# EasyEDA Pro project ProDoc_cyrus_V2.epro, schematic cyrus, sheets 1 to 3 of 5

## Sheets
1 CN3791: Board Name: Board2; Create Date: 2026-04-17; Page Name: CN3791; Project Name: cyrus v1; Schematic Name: cyrus; Update Date: 2026-04-22; Company: EasyEDA.com; Page Size: A3; Version: V1.0
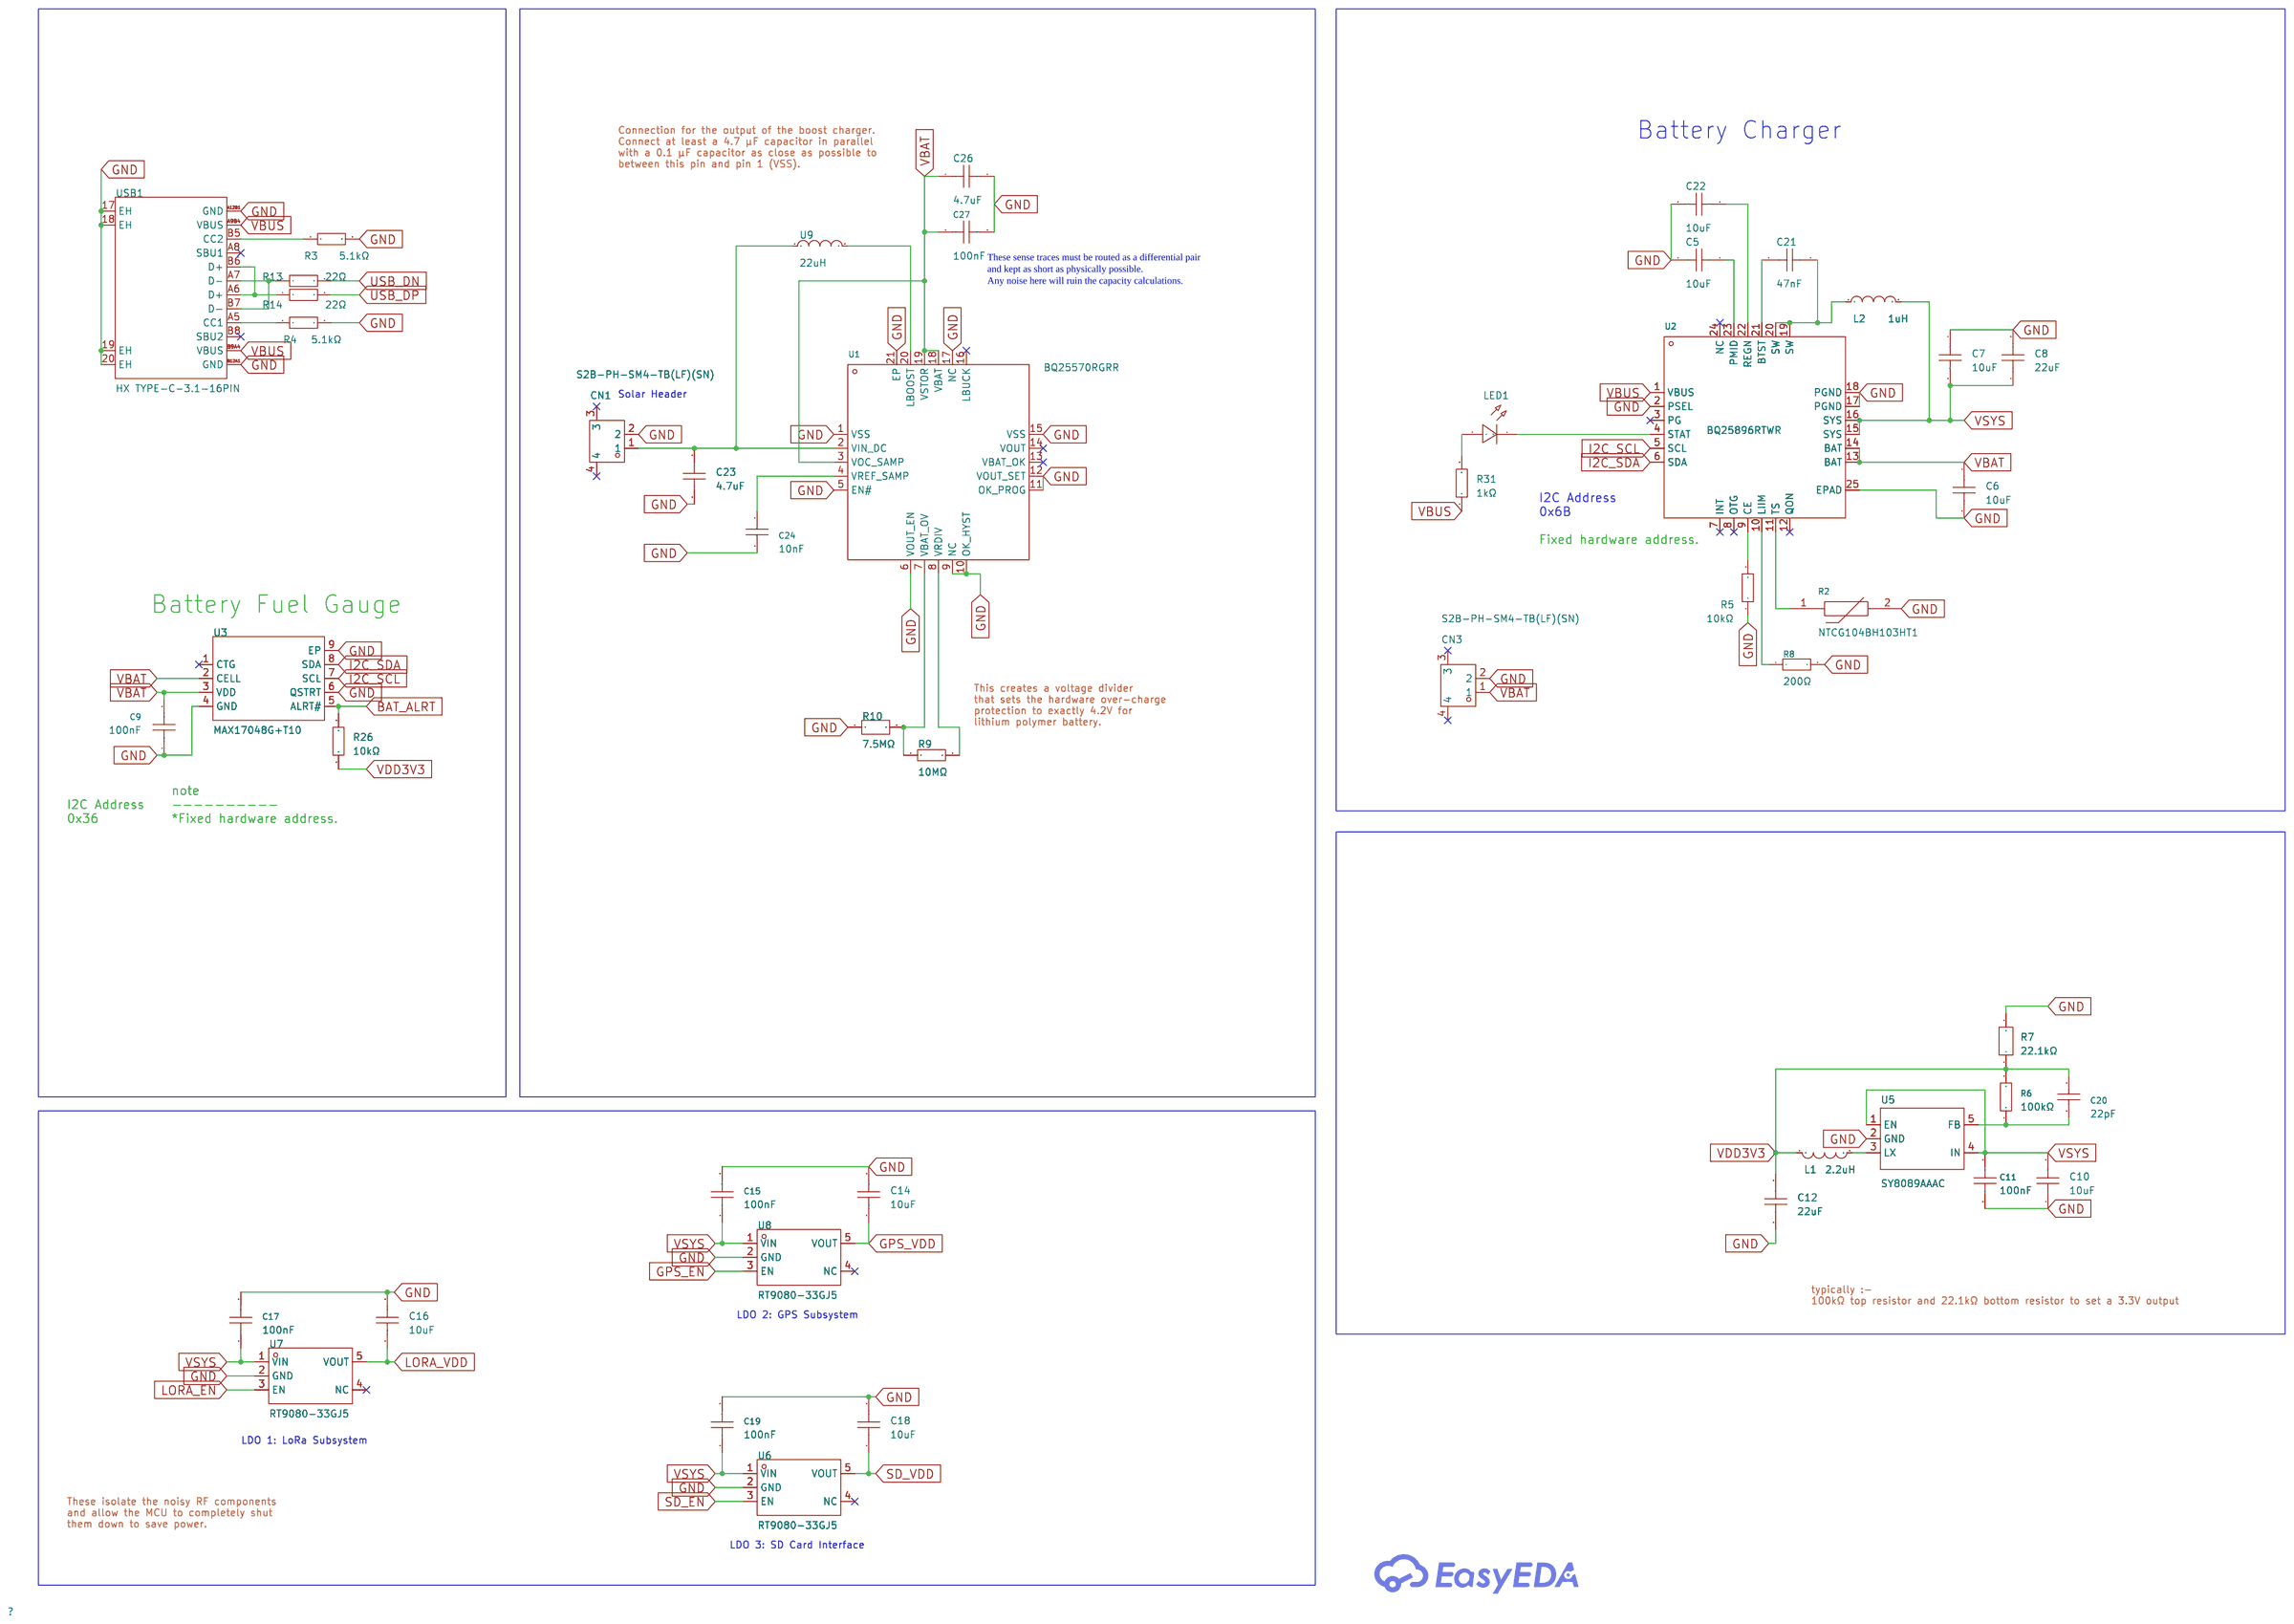
[diagram p0: CN3791]
2 Core Compute: Page Name: Core Compute
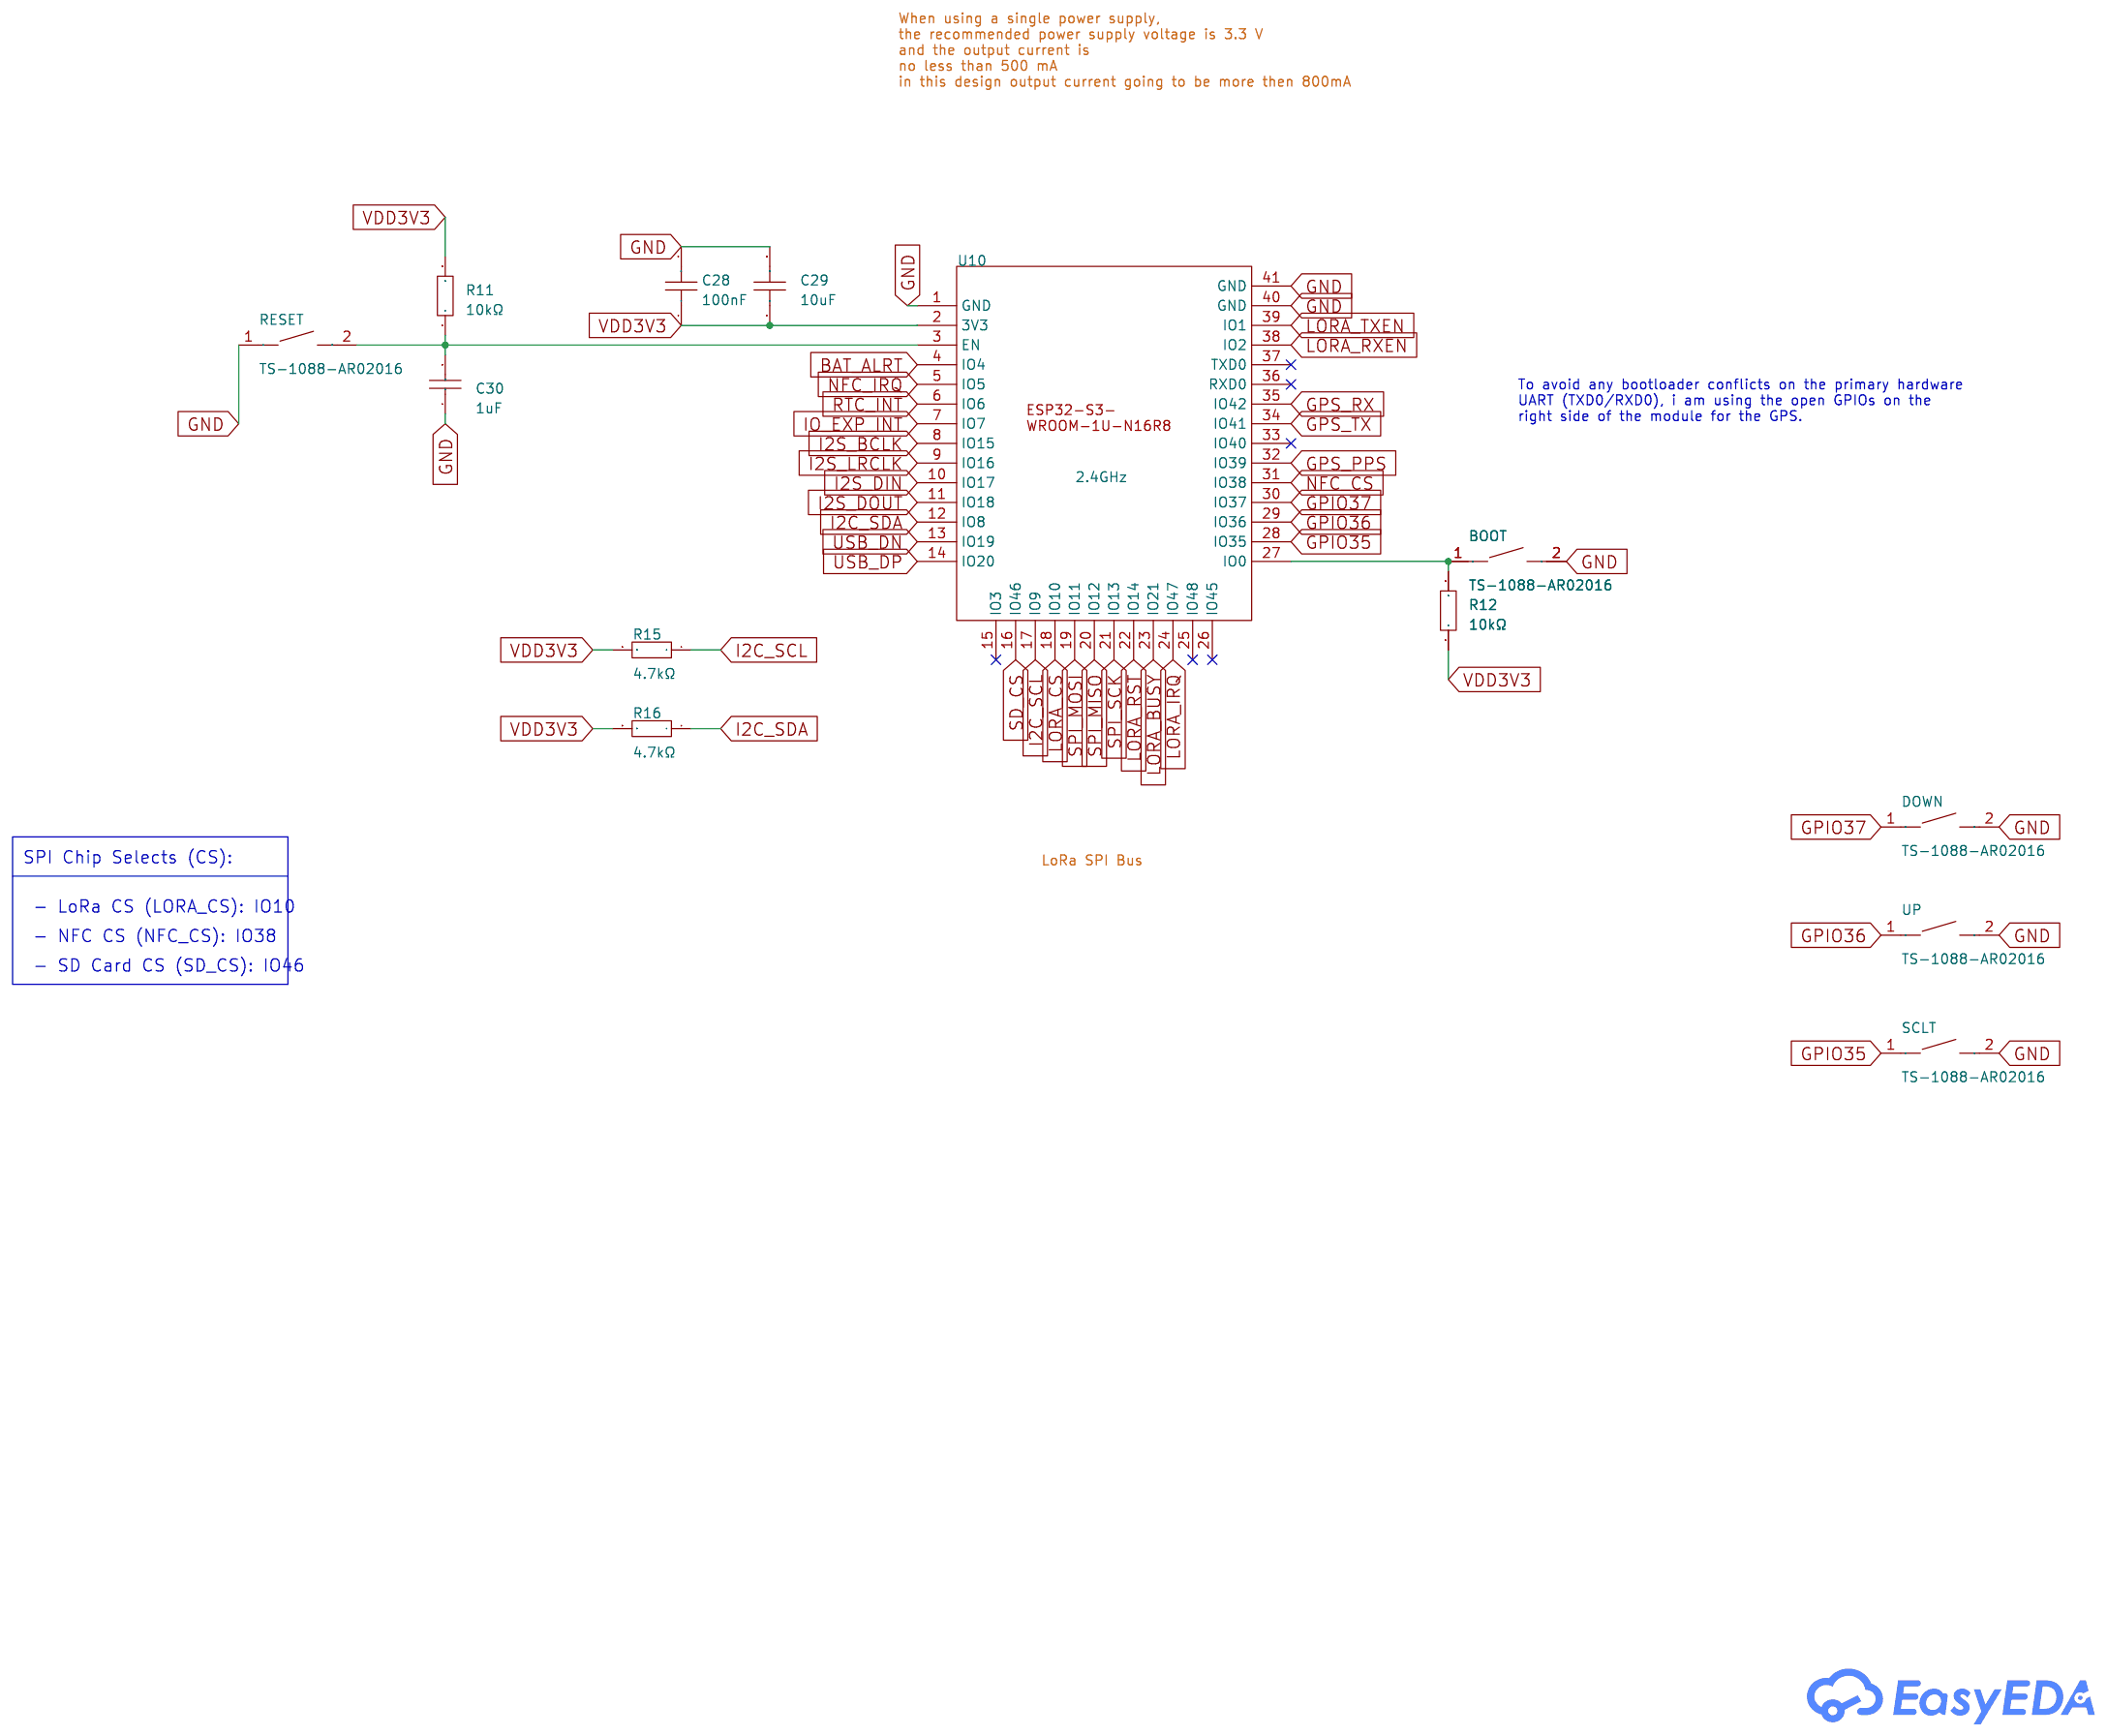
[diagram p1: Core Compute]
3 IO Expansion: Page Name: IO Expansion
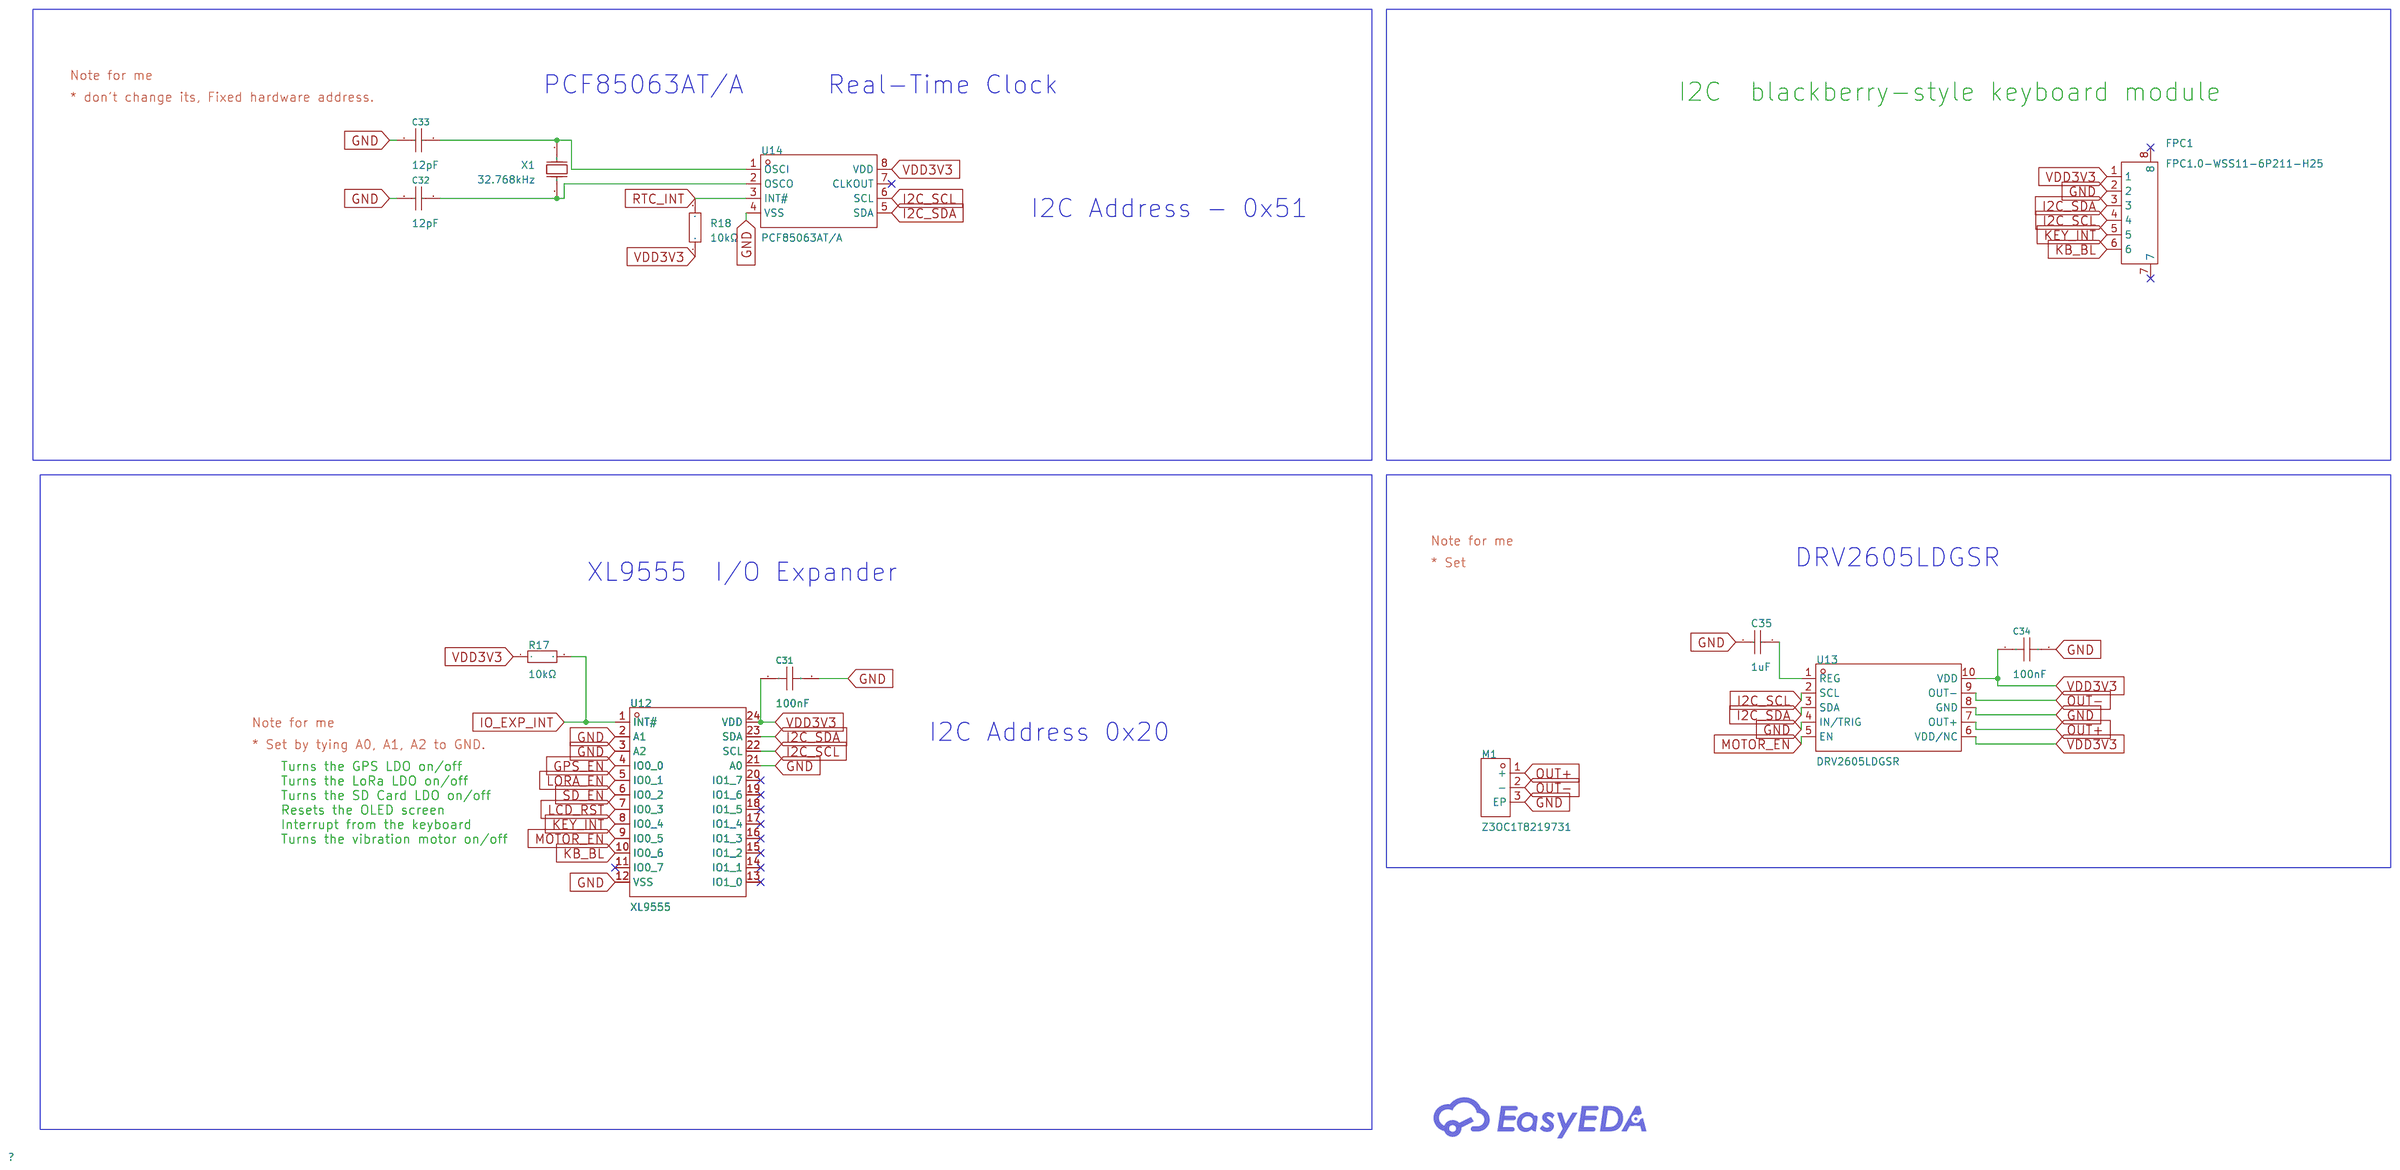
[diagram p2: IO Expansion]

## Parts
sheet CN3791
C5  10uF  [C0402]
C6  10uF  [C0402]
C7  10uF  [C0402]
C8  22uF  [C0603]
C9  100nF  [C0603]
C10  10uF  [C0603]
C11  100nF  [C0603]
C12  22uF  [C0603]
C14  10uF  [C0603]
C15  100nF  [C0603]
C16  10uF  [C0603]
C17  100nF  [C0603]
C18  10uF  [C0603]
C19  100nF  [C0603]
C20  22pF  [C0402]
C21  47nF  [C0402]
C22  10uF  [C0402]
C23  4.7uF  [C0603]
C24  10nF  [C0603]
C26  4.7uF  [C0603]
C27  100nF  [C0603]
CN1  S2B-PH-SM4-TB(LF)(SN)  [CONN-SMD_P2.00_S2B-PH-SM4-TB-LF-SN]
CN3  S2B-PH-SM4-TB(LF)(SN)  [CONN-SMD_P2.00_S2B-PH-SM4-TB-LF-SN]
L1  2.2uH  [L0805]
L2  1uH  [L0805]
LED1  -  [LED0603-RD_GREEN]
R2  NTCG104BH103HT1  [R0402]
R3  5.1kΩ  [R0402]
R4  5.1kΩ  [R0402]
R5  10kΩ  [R0402]
R6  100kΩ  [R0603]
R7  22.1kΩ  [R0603]
R8  200Ω  [R0402]
R9  10MΩ  [R0603]
R10  7.5MΩ  [R0603]
R13  22Ω  [R0402]
R14  22Ω  [R0402]
R26  10kΩ  [R0603]
R31  1kΩ  [R0402]
U1  BQ25570RGRR  [VQFN-20_L3.5-W3.5-P0.50-BL-EP2.0]
U2  BQ25896RTWR  [QFN-24_L4.0-W4.0-P0.50-TL-EP2.7]
U3  MAX17048G+T10  [TDFN-8_L2.0-W2.0-P0.50-BL-EP1.2]
U5  SY8089AAAC  [SOT-23-5_L3.0-W1.7-P0.95-LS2.8-BR]
U6  RT9080-33GJ5  [TSOT-23-5_L2.9-W1.6-P0.95-LS2.8-BL]
U7  RT9080-33GJ5  [TSOT-23-5_L2.9-W1.6-P0.95-LS2.8-BL]
U8  RT9080-33GJ5  [TSOT-23-5_L2.9-W1.6-P0.95-LS2.8-BL]
U9  22uH  [IND-SMD_L1.8-W1.3]
USB1  HX TYPE-C-3.1-16PIN  [TYPE-C-SMD_HX-TYPE-C-16PIN]
sheet Core Compute
BOOT  TS-1088-AR02016  [SW-SMD_L3.9-W2.9-LS4.8]
C28  100nF  [C0402]
C29  10uF  [C0402]
C30  1uF  [C0402]
DOWN  TS-1088-AR02016  [SW-SMD_L3.9-W2.9-LS4.8]
R11  10kΩ  [R0402]
R12  10kΩ  [R0402]
R15  4.7kΩ  [R0402]
R16  4.7kΩ  [R0402]
RESET  TS-1088-AR02016  [SW-SMD_L3.9-W2.9-LS4.8]
SCLT  TS-1088-AR02016  [SW-SMD_L3.9-W2.9-LS4.8]
U10  2.4GHz  [WIRELM-SMD_ESP32-S3-WROOM-1U]
UP  TS-1088-AR02016  [SW-SMD_L3.9-W2.9-LS4.8]
sheet IO Expansion
C31  100nF  [C0402]
C32  12pF  [C0402]
C33  12pF  [C0402]
C34  100nF  [C0402]
C35  1uF  [C0402]
FPC1  FPC1.0-WSS11-6P211-H25  [FPC-SMD_FPC1.0-WSS11-6P211-H25]
M1  Z3OC1T8219731  [VIBRATING-MOTOR-SMD_3P-C9900001680]
R17  10kΩ  [R0402]
R18  10kΩ  [R0402]
U12  XL9555  [TSSOP-24_L7.8-W4.4-P0.65-LS6.4-BL]
U13  DRV2605LDGSR  [DRV2605LDGSR]
U14  PCF85063AT/A  [SO-8_L4.9-W3.9-P1.27-LS5.9-BL]
X1  32.768kHz  [OSC-SMD_L3.2-W1.5]

## Library data of the parts
C5-C7 C22 C29 = CL05A106MP5NUNC_C315248: Capacitance:10uF Tolerance:±20% Tolerance:±20% Voltage Rating:10V Temperature Coefficient:X5R; LCSC Part Name: 10uF ±20% 10V; Supplier Part: C315248; Manufacturer: SAMSUNG(三星); Manufacturer Part: CL05A106MP5NUNC; Supplier Footprint: 0402; JLCPCB Part Class: Extended Part; Datasheet: https://item.szlcsc.com/datasheet/CL05A106MP5NUNC/297154.html; Supplier: LCSC; Tolerance: ±20%; Voltage Rating: 10V; Temperature Coefficient: X5R
C8 C12 = CL10A226MP8NUNE: Capacitance:22uF Tolerance:±20% Tolerance:±20% Voltage Rating:10V Temperature Coefficient:X5R; LCSC Part Name: 22uF ±20% 10V; Supplier Part: C86295; Manufacturer: SAMSUNG(三星); Supplier Footprint: 0603; JLCPCB Part Class: Extended Part; Datasheet: https://item.szlcsc.com/datasheet/CL10A226MP8NUNE/87471.html; Supplier: LCSC; Tolerance: ±20%; Voltage Rating: 10V; Temperature Coefficient: X5R
C9 C11 C15 C17 C19 C27 = CL10B104KB8NNNC: Capacitance:100nF Tolerance:±10% Tolerance:±10% Voltage Rating:50V Temperature Coefficient:X7R; LCSC Part Name: 100nF ±10% 50V; Supplier Part: C1591; Manufacturer: SAMSUNG(三星); Supplier Footprint: 0603; JLCPCB Part Class: Extended Part; Datasheet: https://item.szlcsc.com/datasheet/CL10B104KB8NNNC/1943.html; Supplier: LCSC; Tolerance: ±10%; Voltage Rating: 50V; Temperature Coefficient: X7R
C10 C14 C16 C18 = CL10A106KP8NNNC: Capacitance:10uF Tolerance:±10% Tolerance:±10% Voltage Rating:10V Temperature Coefficient:X5R; LCSC Part Name: 10uF ±10% 10V; Supplier Part: C19702; Manufacturer: SAMSUNG(三星); Supplier Footprint: 0603; JLCPCB Part Class: Basic Part; Datasheet: https://item.szlcsc.com/datasheet/CL10A106KP8NNNC/20411.html; Supplier: LCSC; Tolerance: ±10%; Voltage Rating: 10V; Temperature Coefficient: X5R
C20 = CC0402JRNPO9BN220: Capacitance:22pF Tolerance:±5% Tolerance:±5% Voltage Rating:50V Temperature Coefficient:NP0; LCSC Part Name: 22pF ±5% 50V; Supplier Part: C106203; Manufacturer: YAGEO(国巨); Supplier Footprint: 0402; JLCPCB Part Class: Extended Part; Datasheet: https://item.szlcsc.com/datasheet/CC0402JRNPO9BN220/107418.html; Supplier: LCSC; Tolerance: ±5%; Voltage Rating: 50V; Temperature Coefficient: NP0
C21 = CC0402KRX7R9BB473: Capacitance:47nF Tolerance:±10% Tolerance:±10% Voltage Rating:50V Temperature Coefficient:X7R; LCSC Part Name: 47nF ±10% 50V; Supplier Part: C272875; Manufacturer: YAGEO(国巨); Supplier Footprint: 0402; JLCPCB Part Class: Extended Part; Datasheet: https://item.szlcsc.com/datasheet/CC0402KRX7R9BB473/261267.html; Supplier: LCSC; Tolerance: ±10%; Voltage Rating: 50V; Temperature Coefficient: X7R
C23 C26 = CL10A475KO8NNNC: Capacitance:4.7uF Tolerance:±10% Tolerance:±10% Voltage Rating:16V Temperature Coefficient:X5R; LCSC Part Name: 4.7uF ±10% 16V; Supplier Part: C19666; Manufacturer: SAMSUNG(三星); Supplier Footprint: 0603; JLCPCB Part Class: Basic Part; Datasheet: https://item.szlcsc.com/datasheet/CL10A475KO8NNNC/20375.html; Supplier: LCSC; Tolerance: ±10%; Voltage Rating: 16V; Temperature Coefficient: X5R
C24 = CC0603KRX7R9BB103: Capacitance:10nF Tolerance:±10% Tolerance:±10% Voltage Rating:50V Temperature Coefficient:X7R; LCSC Part Name: 10nF ±10% 50V; Supplier Part: C100042; Manufacturer: YAGEO(国巨); Supplier Footprint: 0603; JLCPCB Part Class: Extended Part; Datasheet: https://item.szlcsc.com/datasheet/CC0603KRX7R9BB103/101256.html; Supplier: LCSC; Tolerance: ±10%; Voltage Rating: 50V; Temperature Coefficient: X7R
CN1 CN3 = S2B-PH-SM4-TB(LF)(SN): Pins Structure:1x2P Pitch:2mm Mounting Style:Horizontal attachment Reference Series:PH Number of Pins:2P Number of Rows:1 Number of PINs Per Row:2 Row Spacing:- Current Rating (Max):2A Contact Material:Copper alloy Contact Plating:Tin Operating Temperatur; LCSC Part Name: 1x2P 间距:2mm 卧贴 系列:PH; Supplier Part: C295747; Manufacturer: JST; Supplier Footprint: SMD,P=2mm,卧贴; JLCPCB Part Class: Extended Part; Datasheet: https://atta.szlcsc.com/upload/public/pdf/source/20210203/C295747_344B2E64535E381E727D98C302AB61C7.pdf; Supplier: LCSC; Pins Structure: 1x2P; Pitch: 2mm; Mounting Style: Horizontal attachment; Reference Series: PH; Number of Pins: 2P; Number of Rows: 1; Number of PINs Per Row: 2; Current Rating (Max): 2A; Contact Material: Copper alloy; Contact Plating: Tin; Operating Temperature Range: -25℃~+85℃; Rated Voltage (Max): 100V; Plastic Material: PA; Flame Retardant Rating: UL94V-0; Supplementary Features: Auxiliary soldering legs; Colour: Beige; Z-Height of the Board: 5.5mm; X-Length of Bottom Edge on Board (Spacing Line): 7.9mm; Y-Width of Bottom Edge on Board: 8.6mm
L1 = ZEPIM201210S-2R2M: Inductance:2.2uH Tolerance:±20% Tolerance:±20% Current Rating:2.2A Current - Saturation(Isat):2.9A DC Resistance(DCR):135mΩ Type:Molded Inductor; LCSC Part Name: 2.2uH ±20% 2.9A; Supplier Part: C48945100; Manufacturer: ZE(增益); Supplier Footprint: 0805; JLCPCB Part Class: Extended Part; Datasheet: https://item.szlcsc.com/datasheet/ZEPIM201210S-2R2M/51263095.html; Supplier: LCSC; Tolerance: ±20%; Current Rating: 2.2A; Current - Saturation(Isat): 2.9A; DC Resistance(DCR): 135mΩ; Type: Molded Inductor
L2 = DFE201210U-1R0M=P2: Inductance:1uH Tolerance:±20% Tolerance:±20% Current Rating:2A Current - Saturation(Isat):3.1A DC Resistance(DCR):95mΩ Ratings:-; LCSC Part Name: 1uH ±20% 3.1A; Supplier Part: C1331798; Manufacturer: muRata(村田); Supplier Footprint: 0805; JLCPCB Part Class: Extended Part; Datasheet: https://item.szlcsc.com/datasheet/DFE201210U-1R0M%253DP2/1422077.html; Supplier: LCSC; Tolerance: ±20%; Current Rating: 2A; Current - Saturation(Isat): 3.1A; DC Resistance(DCR): 95mΩ
LED1 = LED_0603-G
R2 = NTCG104BH103HT1: Resistance @ 25℃:10kΩ B Constant (25℃/50℃):4067K Resistance Tolerance:±3% Resistance Tolerance:±3% B Constant (25℃/75℃):4092K B Constant (25℃/85℃):4100K B Constant (25℃/100℃):4110K Power(Watts):100mW B Constant Tolerance:±3% Steady State Current (Max):310; LCSC Part Name: 10kΩ 4067K 100mW; Supplier Part: C531300; Manufacturer: TDK; Supplier Footprint: 0402; JLCPCB Part Class: Extended Part; Datasheet: https://item.szlcsc.com/datasheet/NTCG104BH103HT1/551461.html; Supplier: LCSC; Resistance @ 25℃: 10kΩ; B Constant (25℃/50℃): 4067K; Resistance Tolerance: ±3%; B Constant (25℃/75℃): 4092K; B Constant (25℃/85℃): 4100K; B Constant (25℃/100℃): 4110K; Power(Watts): 100mW; B Constant Tolerance: ±3%; Steady State Current (Max): 310uA; Operating Temperature: -40℃~+125℃; Dissipation Factor: 1mW/℃; Length: 1mm; Width: 0.5mm; Height: 0.5mm
R3 R4 = RC0402FR-075K1L: Type:Thick Film Resistor Resistance:5.1kΩ Tolerance:±1% Tolerance:±1% Power(Watts):62.5mW Voltage-Supply(Max):50V Temperature Coefficient:±100ppm/℃ Temperature Coefficient:±100ppm/℃ Operating Temperature:-55℃~+155℃ Operating Temperature:-55℃~+155℃; LCSC Part Name: 厚膜电阻 5.1kΩ ±1% 62.5mW; Supplier Part: C105872; Manufacturer: YAGEO(国巨); Supplier Footprint: 0402; JLCPCB Part Class: Extended Part; Datasheet: https://item.szlcsc.com/datasheet/RC0402FR-075K1L/107087.html; Supplier: LCSC; Type: Thick Film Resistor; Tolerance: ±1%; Power(Watts): 62.5mW; Voltage-Supply(Max): 50V; Temperature Coefficient: ±100ppm/℃; Operating Temperature: -55℃~+155℃
R5 = ERJ2RKF1002X: Type:Thick Film Resistor Resistance:10kΩ Tolerance:±1% Tolerance:±1% Power(Watts):100mW Voltage-Supply(Max):50V Temperature Coefficient:±100ppm/℃ Temperature Coefficient:±100ppm/℃ Operating Temperature:-55℃~+155℃ Operating Temperature:-55℃~+155℃; LCSC Part Name: 停产 10kΩ ±1% 100mW 厚膜电阻; Supplier Part: C191123; Manufacturer: PANASONIC(松下); Supplier Footprint: 0402; JLCPCB Part Class: Extended Part; Datasheet: https://item.szlcsc.com/datasheet/ERJ2RKF1002X/213966.html; Supplier: LCSC; Type: Thick Film Resistor; Tolerance: ±1%; Power(Watts): 100mW; Voltage-Supply(Max): 50V; Temperature Coefficient: ±100ppm/℃; Operating Temperature: -55℃~+155℃
R6 = RC0603FR-07100KL: Type:Thick Film Resistors Resistance: Tolerance:±1% Tolerance:±1% Power(Watts): Overload Voltage (Max): Temperature Coefficient:±100ppm/℃ Temperature Coefficient:±100ppm/℃ Operating Temperature Range:-55℃~+155℃ Operating Temperature Range:-55℃~+155℃; LCSC Part Name: 厚膜电阻 100kΩ ±1% 100mW; Supplier Part: C14675; Manufacturer: YAGEO(国巨); Supplier Footprint: 0603; JLCPCB Part Class: Extended Part; Datasheet: https://atta.szlcsc.com/upload/public/pdf/source/20140324/1457707028752.pdf; Supplier: LCSC; Type: Thick Film Resistors; Tolerance: ±1%; Temperature Coefficient: ±100ppm/℃; Operating Temperature Range: -55℃~+155℃
R7 = FRC0603F2212TS: Type:Thick Film Resistor Resistance:22.1kΩ Tolerance:±1% Tolerance:±1% Power(Watts):100mW Voltage-Supply(Max):75V Temperature Coefficient:±100ppm/℃ Temperature Coefficient:±100ppm/℃ Operating Temperature:-55℃~+155℃ Operating Temperature:-55℃~+155℃; LCSC Part Name: 22.1kΩ ±1% 100mW 厚膜电阻; Supplier Part: C2960862; Manufacturer: FOJAN(富捷); Supplier Footprint: 0603; JLCPCB Part Class: Extended Part; Supplier: LCSC; Type: Thick Film Resistor; Tolerance: ±1%; Power(Watts): 100mW; Voltage-Supply(Max): 75V; Temperature Coefficient: ±100ppm/℃; Operating Temperature: -55℃~+155℃
R8 = 0402WGF2000TCE: Type:Thick Film Resistor Resistance:200Ω Tolerance:±1% Tolerance:±1% Power(Watts):62.5mW Voltage-Supply(Max):50V Temperature Coefficient:±100ppm/℃ Temperature Coefficient:±100ppm/℃ Operating Temperature:-55℃~+155℃ Operating Temperature:-55℃~+155℃; LCSC Part Name: 200Ω ±1% 62.5mW 厚膜电阻; Supplier Part: C25087; Manufacturer: UNI-ROYAL(厚声); Supplier Footprint: 0402; JLCPCB Part Class: Basic Part; Datasheet: https://item.szlcsc.com/datasheet/0402WGF2000TCE/25830.html; Supplier: LCSC; Type: Thick Film Resistor; Tolerance: ±1%; Power(Watts): 62.5mW; Voltage-Supply(Max): 50V; Temperature Coefficient: ±100ppm/℃; Operating Temperature: -55℃~+155℃
R9 = RC0603FR-0710ML: Type:Thick Film Resistor Resistance:10MΩ Tolerance:±1% Tolerance:±1% Power(Watts):100mW Voltage-Supply(Max):75V Temperature Coefficient:±100ppm/℃ Temperature Coefficient:±100ppm/℃ Operating Temperature:-55℃~+155℃ Operating Temperature:-55℃~+155℃; LCSC Part Name: 厚膜电阻 10MΩ ±1% 100mW; Supplier Part: C114606; Manufacturer: YAGEO(国巨); Supplier Footprint: 0603; JLCPCB Part Class: Extended Part; Datasheet: https://item.szlcsc.com/datasheet/RC0603FR-0710ML/115850.html; Supplier: LCSC; Type: Thick Film Resistor; Tolerance: ±1%; Power(Watts): 100mW; Voltage-Supply(Max): 75V; Temperature Coefficient: ±100ppm/℃; Operating Temperature: -55℃~+155℃
R10 = FRC0603F7504TS: Type:Thick Film Resistor Resistance:7.5MΩ Tolerance:±1% Tolerance:±1% Power(Watts):100mW Voltage-Supply(Max):75V Temperature Coefficient:±100ppm/℃ Temperature Coefficient:±100ppm/℃ Operating Temperature:-55℃~+155℃ Operating Temperature:-55℃~+155℃; LCSC Part Name: 7.5MΩ ±1% 100mW 厚膜电阻; Supplier Part: C2999500; Manufacturer: FOJAN(富捷); Supplier Footprint: 0603; JLCPCB Part Class: Extended Part; Supplier: LCSC; Type: Thick Film Resistor; Tolerance: ±1%; Power(Watts): 100mW; Voltage-Supply(Max): 75V; Temperature Coefficient: ±100ppm/℃; Operating Temperature: -55℃~+155℃
R13 R14 = RC0402FR-0722RL: Type:Thick Film Resistors Resistance: Tolerance:±1% Tolerance:±1% Power(Watts): Overload Voltage (Max): Temperature Coefficient:±100ppm/℃ Temperature Coefficient:±100ppm/℃ Operating Temperature Range:-55℃~+155℃ Operating Temperature Range:-55℃~+155℃; LCSC Part Name: 厚膜电阻 22Ω ±1% 62.5mW; Supplier Part: C114765; Manufacturer: YAGEO(国巨); Supplier Footprint: 0402; JLCPCB Part Class: Extended Part; Datasheet: https://atta.szlcsc.com/upload/public/pdf/source/20180821/C275644_0D56F95EFF785E7D9A1FEF436B37DA78.pdf; Supplier: LCSC; Type: Thick Film Resistors; Tolerance: ±1%; Temperature Coefficient: ±100ppm/℃; Operating Temperature Range: -55℃~+155℃
R26 = RC0603FR-0710KL: Type:Thick Film Resistors Resistance: Tolerance:±1% Tolerance:±1% Power(Watts): Overload Voltage (Max): Temperature Coefficient:±100ppm/℃ Temperature Coefficient:±100ppm/℃ Operating Temperature Range:-55℃~+155℃ Operating Temperature Range:-55℃~+155℃; LCSC Part Name: 厚膜电阻 10kΩ ±1% 100mW; Supplier Part: C98220; Manufacturer: YAGEO(国巨); Supplier Footprint: 0603; JLCPCB Part Class: Extended Part; Datasheet: https://atta.szlcsc.com/upload/public/pdf/source/20180927/C295883_E8D83085EA81BD7DE0B2B681138C15EE.pdf; Supplier: LCSC; Type: Thick Film Resistors; Tolerance: ±1%; Temperature Coefficient: ±100ppm/℃; Operating Temperature Range: -55℃~+155℃
R31 = RC0402FR-071KL: Type:Thick Film Resistor Resistance:1kΩ Tolerance:±1% Tolerance:±1% Power(Watts):62.5mW Voltage-Supply(Max):50V Temperature Coefficient:±100ppm/℃ Temperature Coefficient:±100ppm/℃ Operating Temperature:-55℃~+155℃ Operating Temperature:-55℃~+155℃; LCSC Part Name: 厚膜电阻 1kΩ ±1% 62.5mW; Supplier Part: C106235; Manufacturer: YAGEO(国巨); Supplier Footprint: 0402; JLCPCB Part Class: Extended Part; Datasheet: https://item.szlcsc.com/datasheet/RC0402FR-071KL/107450.html; Supplier: LCSC; Type: Thick Film Resistor; Tolerance: ±1%; Power(Watts): 62.5mW; Voltage-Supply(Max): 50V; Temperature Coefficient: ±100ppm/℃; Operating Temperature: -55℃~+155℃
U1 = BQ25570RGRR: Operating Temperature:-40℃~+125℃ Operating Temperature:-40℃~+125℃; LCSC Part Name: 适用于能量收集器供电应用的微功率升压充电器与降压转换器; Supplier Part: C506250; Manufacturer: TI(德州仪器); Supplier Footprint: VQFN-20-EP(3.5x3.5); JLCPCB Part Class: Extended Part; Datasheet: https://www.ti.com/cn/lit/gpn/bq25570; Supplier: LCSC; Operating Temperature: -40℃~+125℃
U2 = BQ25896RTWR: The Chip Type:Charging IC Voltage - Supply:3.9V~14V Voltage - Supply:3.9V~14V Charge Current - Max:3A Charging Saturation Voltage:4.208V End-Off Voltage:- Type of Battery:Lithium Battery Number of Cells:1 Number of Cells:1 Operating Temperature:-40℃~+85℃; LCSC Part Name: I²C控制单节3A快速充电器，具备高输入电压MaxCharge技术和可调电压USB OTG升压模式; Supplier Part: C181475; Manufacturer: TI(德州仪器); Supplier Footprint: QFN-24-EP(4x4); JLCPCB Part Class: Extended Part; Datasheet: https://www.ti.com/cn/lit/gpn/bq25896; Supplier: LCSC; The Chip Type: Charging IC; Voltage - Supply: 3.9V~14V; Charge Current - Max: 3A; Charging Saturation Voltage: 4.208V; Type of Battery: Lithium Battery; Number of Cells: 1; Operating Temperature: -40℃~+85℃; Battery Temperature Detection: Support; Supply Current (Iq): 12uA; Interface: I2C
U3 = MAX17048G+T10: The Chip Type:Monitoring IC Voltage - Supply:2.5V~4.5V Voltage - Supply:2.5V~4.5V Charge Current - Max:- Charging Saturation Voltage:- End-Off Voltage:- Type of Battery:Lithium Battery Number of Cells:1 Number of Cells:1 Operating Temperature:-40℃~+85℃ Op; LCSC Part Name: 3uA单节/双节电池电量计，带ModelGauge算法; Supplier Part: C2682616; Manufacturer: ADI(亚德诺)/MAXIM(美信); Supplier Footprint: DFN-8-EP(2x2); JLCPCB Part Class: Extended Part; Datasheet: https://item.szlcsc.com/datasheet/MAX17048G%252BT10/2777647.html; Supplier: LCSC; The Chip Type: Monitoring IC; Voltage - Supply: 2.5V~4.5V; Type of Battery: Lithium Battery; Number of Cells: 1; Operating Temperature: -40℃~+85℃; Battery Temperature Detection: Not supported; 0V Battery Charge: Not supported; Supply Current (Iq): 3uA; Interface: I2C
U5 = SY8089AAAC: Function:Buck Voltage - Supply:2.7V~5.5V Voltage - Supply:2.7V~5.5V Output Voltage:- Output Voltage:- Output Current:2A Frequency - Switching:1MHz Frequency - Switching:1MHz Operating Temperature:-40℃~+85℃@(TA) Operating Temperature:-40℃~+85℃@(TA) Synchro; LCSC Part Name: 高效率2A连续输出同步降压DC-DC调节器; Supplier Part: C78988; Manufacturer: Silergy(矽力杰); Supplier Footprint: SOT-23-5; JLCPCB Part Class: Extended Part; Datasheet: https://item.szlcsc.com/datasheet/SY8089AAAC/80125.html; Supplier: LCSC; Function: Buck; Voltage - Supply: 2.7V~5.5V; Output Current: 2A; Frequency - Switching: 1MHz; Operating Temperature: -40℃~+85℃@(TA); Synchronous Rectifier: Yes; Number of Outputs: 1; Topology: Buck; Quiescent Current: 55uA; Switch tube (built-in/external): Built-in; Output Type: Adjustable
U6-U8 = RT9080-33GJ5: Output Type:Fixed Voltage - Supply:5.5V Output Voltage:3.3V Output Voltage:3.3V Output Current:600mA Power Supply Rejection Ratio (PSRR):75dB@(1kHz) Voltage Dropout:360mV@(600mA) standby current:2uA Noise:42uVrms Features:Enable；Over Temperature Protectio; LCSC Part Name: 静态电流2μA，输出电流600mA的低压差线性稳压器; Supplier Part: C841192; Manufacturer: RICHTEK(立锜); Supplier Footprint: TSOT-23-5; JLCPCB Part Class: Extended Part; Datasheet: https://item.szlcsc.com/datasheet/RT9080-33GJ5/897967.html; Supplier: LCSC; Output Type: Fixed; Voltage - Supply: 5.5V; Output Voltage: 3.3V; Output Current: 600mA; Power Supply Rejection Ratio (PSRR): 75dB@(1kHz); Voltage Dropout: 360mV@(600mA); standby current: 2uA; Noise: 42uVrms; Features: Enable；Over Temperature Protection；Over Current Protection; Operating Temperature: -40℃~+125℃@(Tj); Output Configuration: Positive; Number of Outputs: 1
U9 = AHW1608FE220KTF: Inductance: Tolerance:±10% Tolerance:±10% Rated Current: DC Resistance (DCR):4.69Ω Q @ Freq:14 Frequency - Self Resonant: Type:Wire-wound Chip Inductor; LCSC Part Name: 22uH ±10%; Supplier Part: C6808015; Manufacturer: APV(爱普微); Supplier Footprint: 0603; JLCPCB Part Class: Extended Part; Datasheet: https://atta.szlcsc.com/upload/public/pdf/source/20230801/BB08BAF005D51D8CB3E22DF937F0D567.pdf; Supplier: LCSC; Tolerance: ±10%; DC Resistance (DCR): 4.69Ω; Q @ Freq: 14; Type: Wire-wound Chip Inductor
USB1 = HX TYPE-C-3.1-16PIN: Connector Type:Type-C Protocol Standard:USB 3.1 Gender:Female Mounting Type:Surface Mount, Right Angle Number of Contacts:16P Number of Ports:1 Current Rating-Power:3A Voltage Rating:20V Connect-Disconnect Life:5,000 times Supplementary Features:- Center; LCSC Part Name: Type-C 母 卧贴; Supplier Part: C18357551; Manufacturer: hanxia(韩下); Supplier Footprint: SMD; JLCPCB Part Class: Extended Part; Datasheet: https://item.szlcsc.com/datasheet/HX%2520TYPE-C-3.1-16PIN/19545721.html; Supplier: LCSC; Connector Type: Type-C; Protocol Standard: USB 3.1; Gender: Female; Mounting Type: Surface Mount, Right Angle; Number of Contacts: 16P; Number of Ports: 1; Current Rating-Power: 3A; Voltage Rating: 20V; Connect-Disconnect Life: 5,000 times; Center Height: 1.68mm; Length: 7.35mm; Detection color: Black; Operating Temperature: -30℃~+80℃
BOOT DOWN RESET SCLT UP = TS-1088-AR02016: Circuit:SPST Actuator Style:Round Button Operating Force:1.6N Mounting Type:Surface Mount,Vertical Length:4mm Width:3mm Switch Height:2mm with Bracket:Without Bracket Contact Current:50mA Voltage Rating:12V Actuator/Cap Color:Black Termination Style:SMD(S; LCSC Part Name: 4*3*2mm 立贴 轻触开关; Supplier Part: C720477; Manufacturer: XUNPU(讯普); Supplier Footprint: SMD,4x3mm; JLCPCB Part Class: Basic Part; Datasheet: https://item.szlcsc.com/datasheet/TS-1088-AR02016/763484.html; Supplier: LCSC; Circuit: SPST; Actuator Style: Round Button; Operating Force: 1.6N; Mounting Type: Surface Mount,Vertical; Length: 4mm; Width: 3mm; Switch Height: 2mm; with Bracket: Without Bracket; Contact Current: 50mA; Voltage Rating: 12V; Actuator/Cap Color: Black; Termination Style: SMD(SMT) Tab; Life: 100,000 Cycles; Operating Temperature: -30℃~+80℃
C28 = CL05B104KO5NNNC: Capacitance:100nF Tolerance:±10% Tolerance:±10% Voltage Rating:16V Temperature Coefficient:X7R; LCSC Part Name: 100nF ±10% 16V; Supplier Part: C1525; Manufacturer: SAMSUNG(三星); Supplier Footprint: 0402; JLCPCB Part Class: Basic Part; Datasheet: https://item.szlcsc.com/datasheet/CL05B104KO5NNNC/1877.html; Supplier: LCSC; Tolerance: ±10%; Voltage Rating: 16V; Temperature Coefficient: X7R
C30 C35 = CL05A105KP5NNNC: Capacitance:1uF Tolerance:±10% Tolerance:±10% Voltage Rating:10V Temperature Coefficient:X5R; LCSC Part Name: 1uF ±10% 10V; Supplier Part: C14445; Manufacturer: SAMSUNG(三星); Supplier Footprint: 0402; JLCPCB Part Class: Extended Part; Datasheet: https://item.szlcsc.com/datasheet/CL05A105KP5NNNC/15107.html; Supplier: LCSC; Tolerance: ±10%; Voltage Rating: 10V; Temperature Coefficient: X5R
R11 R12 R17 R18 = RC0402FR-0710KL: Type:Thick Film Resistor Resistance:10kΩ Tolerance:±1% Tolerance:±1% Power(Watts):62.5mW Voltage-Supply(Max):50V Temperature Coefficient:±100ppm/℃ Temperature Coefficient:±100ppm/℃ Operating Temperature:-55℃~+155℃ Operating Temperature:-55℃~+155℃; LCSC Part Name: 厚膜电阻 10kΩ ±1% 62.5mW; Supplier Part: C60490; Manufacturer: YAGEO(国巨); Supplier Footprint: 0402; JLCPCB Part Class: Extended Part; Datasheet: https://item.szlcsc.com/datasheet/RC0402FR-0710KL/61542.html; Supplier: LCSC; Type: Thick Film Resistor; Tolerance: ±1%; Power(Watts): 62.5mW; Voltage-Supply(Max): 50V; Temperature Coefficient: ±100ppm/℃; Operating Temperature: -55℃~+155℃
R15 R16 = RC0402FR-074K7L: Type:Thick Film Resistor Resistance:4.7kΩ Tolerance:±1% Tolerance:±1% Power(Watts):62.5mW Voltage-Supply(Max):50V Temperature Coefficient:±100ppm/℃ Temperature Coefficient:±100ppm/℃ Operating Temperature:-55℃~+155℃ Operating Temperature:-55℃~+155℃; LCSC Part Name: 厚膜电阻 4.7kΩ ±1% 62.5mW; Supplier Part: C105871; Manufacturer: YAGEO(国巨); Supplier Footprint: 0402; JLCPCB Part Class: Extended Part; Datasheet: https://item.szlcsc.com/datasheet/RC0402FR-074K7L/107086.html; Supplier: LCSC; Type: Thick Film Resistor; Tolerance: ±1%; Power(Watts): 62.5mW; Voltage-Supply(Max): 50V; Temperature Coefficient: ±100ppm/℃; Operating Temperature: -55℃~+155℃
U10 = ESP32-S3-WROOM-1U-N16R8: Utilized IC / Part:ESP32-S3R8 Wireless Standard:Bluetooth5.0 Interface Type:I2C；GPIO；JTAG；UART；SPI；PWM；SDIO；ADC；USB；I2S Frequency:2.4GHz Output Power:20.5dBm Output Power:20.5dBm Voltage - Supply:3V~3.6V Voltage - Supply:3V~3.6V Receive  Current:95mA Send; LCSC Part Name: 不带固件 2.4GHz Wi-Fi (802.11b/g/n) + 蓝牙 5 (LE) 模组; Supplier Part: C3013946; Manufacturer: ESPRESSIF(乐鑫); Supplier Footprint: SMD,19.2x18mm; JLCPCB Part Class: Extended Part; Datasheet: https://item.szlcsc.com/datasheet/ESP32-S3-WROOM-1U-N16R8/3522416.html; Supplier: LCSC; Utilized IC / Part: ESP32-S3R8; Wireless Standard: Bluetooth5.0; Interface Type: I2C；GPIO；JTAG；UART；SPI；PWM；SDIO；ADC；USB；I2S; Output Power: 20.5dBm; Voltage - Supply: 3V~3.6V; Receive  Current: 95mA; Send  Current: 355mA; Sensitivity: -103.5dBm; Operating Temperature: -40℃~+65℃
C31 C34 = CC0402KRX7R7BB104: Capacitance: Tolerance:±10% Tolerance:±10% Voltage Rated: Temperature Coefficient:; LCSC Part Name: 100nF ±10% 16V; Supplier Part: C60474; Manufacturer: YAGEO(国巨); Supplier Footprint: 0402; JLCPCB Part Class: Extended Part; Datasheet: https://atta.szlcsc.com/upload/public/pdf/source/20211223/9278FD768280B81DDBEF48FA36411A03.pdf; Supplier: LCSC; Tolerance: ±10%
C32 C33 = CC0402JRNPO9BN120: Capacitance:12pF Tolerance:±5% Tolerance:±5% Voltage Rating:50V Temperature Coefficient:NP0; LCSC Part Name: 12pF ±5% 50V; Supplier Part: C106201; Manufacturer: YAGEO(国巨); Supplier Footprint: 0402; JLCPCB Part Class: Extended Part; Datasheet: https://item.szlcsc.com/datasheet/CC0402JRNPO9BN120/107416.html; Supplier: LCSC; Tolerance: ±5%; Voltage Rating: 50V; Temperature Coefficient: NP0
FPC1 = FPC1.0-WSS11-6P211-H25: Locking Feature:Slide Lock Contact Type:Top Contact Number of Contacts:6P Pitch:1mm Mounting Type:Surface Mount, Right Angle FFC, FCB Thickness:0.3mm FFC, FCB Thickness:0.3mm Height Above Board:2.5mm Contact Material:Copper Alloy Contact Plating:Gold Oper; LCSC Part Name: 抽屉式 上接 P数:6P 间距:1mm; Supplier Part: C42407887; Manufacturer: HMTCONN(华明通); Supplier Footprint: SMD,P=1mm,卧贴; JLCPCB Part Class: Extended Part; Datasheet: https://item.szlcsc.com/datasheet/FPC1.0-WSS11-6P211-H25/44382158.html; Supplier: LCSC; Locking Feature: Slide Lock; Contact Type: Top Contact; Number of Contacts: 6P; Pitch: 1mm; Mounting Type: Surface Mount, Right Angle; FFC, FCB Thickness: 0.3mm; Height Above Board: 2.5mm; Contact Material: Copper Alloy; Contact Plating: Gold; Operating Temperature: -25℃~+85℃
M1 = Z3OC1T8219731: Type:Cylindrical DC Motor Voltage Rating:2.7V Voltage Rating:2.7V Current Rating:85mA Rated Speed:14000rpm Rated Speed:14000rpm Operating Temperature:-20℃~+70℃ Operating Temperature:-20℃~+70℃ Sense Of Rotation:CW Mounting Type:SMD; LCSC Part Name: 圆柱直流马达; Supplier Part: C2894731; Manufacturer: KOTL(金龙机电); JLCPCB Part Class: Extended Part; Datasheet: https://item.szlcsc.com/datasheet/Z3OC1T8219731/3130478.html; Supplier: LCSC; Type: Cylindrical DC Motor; Voltage Rating: 2.7V; Current Rating: 85mA; Rated Speed: 14000rpm; Operating Temperature: -20℃~+70℃; Sense Of Rotation: CW; Mounting Type: SMD
U12 = XL9555: Interface:I2C；SMBus Number of I/O:16 Interrupt Output:With Interrupt Output Output Type: Supply Voltage:2.3V~5.5V Supply Voltage:2.3V~5.5V Output Source current:- Output Sink Current:- Clock Frequency:400kHz Operating Temperature:-40℃~+85℃ Operating Tempe; LCSC Part Name: 16位I²C总线和SMBus I/O端口扩展器，带中断输出和配置寄存器; Supplier Part: C609791; Manufacturer: XINLUDA(信路达); Supplier Footprint: TSSOP-24; JLCPCB Part Class: Extended Part; Datasheet: https://atta.szlcsc.com/upload/public/pdf/source/20240911/FFF826D97BDA33B4BE55BC4C2C305DC8.pdf; Supplier: LCSC; Interface: I2C；SMBus; Number of I/O: 16; Interrupt Output: With Interrupt Output; Supply Voltage: 2.3V~5.5V; Clock Frequency: 400kHz; Operating Temperature: -40℃~+85℃
U13 = DRV2605LDGSR: Technology:Yes Number of H-bridges:1 Output Current:- Output Current:- Peak Current:- Voltage - Supply:2V~5.2V Voltage - Supply:2V~5.2V Interface:I2C RDS(on):- Quiescent Current(Iq):500uA Operating Temperature:-40℃~+85℃ Operating Temperature:-40℃~+85℃; LCSC Part Name: 5.5V电机驱动芯片; Supplier Part: C527464; Manufacturer: TI(德州仪器); Supplier Footprint: VSSOP-10-0.5mm; JLCPCB Part Class: Extended Part; Datasheet: https://www.ti.com/cn/lit/gpn/drv2605l; Supplier: LCSC; Technology: Yes; Number of H-bridges: 1; Voltage - Supply: 2V~5.2V; Interface: I2C; Quiescent Current(Iq): 500uA; Operating Temperature: -40℃~+85℃
U14 = PCF85063AT/A: Supplier Part: C2669637; Manufacturer: NXP(恩智浦); Supplier Footprint: SO-8; JLCPCB Part Class: Extended Part; Datasheet: https://www.nxp.com/docs/en/data-sheet/PCF85063A.pdf; Supplier: LCSC
X1 = SMD31327681252090: Type:Crystal Oscillator Frequency:32.768kHz Normal temperature Frequency Tolerance:±20ppm Normal temperature Frequency Tolerance:±20ppm Load Capacitance:12.5pF Equivalent Series Resistance(ESR):90kΩ Operating Temperature:-40℃~+85℃ Operating Temperature:-4; LCSC Part Name: 32.768kHz ±20ppm 12.5pF; Supplier Part: C390740; Manufacturer: JGHC(晶光华); Supplier Footprint: SMD3215-2P; JLCPCB Part Class: Extended Part; Datasheet: https://item.szlcsc.com/datasheet/SMD31327681252090/366942.html; Supplier: LCSC; Type: Crystal Oscillator; Normal temperature Frequency Tolerance: ±20ppm; Load Capacitance: 12.5pF; Equivalent Series Resistance(ESR): 90kΩ; Operating Temperature: -40℃~+85℃

## Nets
GND: BOOT.2 C5.2 C6.2 C7.1 C8.2 C9.1 C10.1 C11.1 C12.1 C14.2 C15.2 C16.2 C17.2 C18.2 C19.2 C22.2 C23.1 C24.1 C26.2 C27.2 C28.2 C29.2 C30.1 C31.2 C32.1 C33.1 C34.2 C35.1 CN1.2 CN3.2 DOWN.2 FPC1.2 M1.3(EP) R2.2 R3.2 R4.2 R5.1 R7.2 R8.2 R10.1 RESET.1 SCLT.2 U1.1(VSS) U1.5(EN#) U1.6(VOUT_EN) U1.9(NC) U1.10(OK_HYST) U1.11(OK_PROG) U1.12(VOUT_SET) U1.15(VSS) U1.17(NC) U1.21(EP) U2.2(PSEL) U2.17(PGND) U2.18(PGND) U2.25(EPAD) U3.4(GND) U3.6(QSTRT) U3.9(EP) U5.2(GND) U6.2(GND) U7.2(GND) U8.2(GND) U10.1(GND) U10.40(GND) U10.41(GND) U12.2(A1) U12.3(A2) U12.12(VSS) U12.21(A0) U13.4(IN/TRIG) U13.8(GND) U14.4(VSS) UP.2 USB1.17(EH) USB1.18(EH) USB1.19(EH) USB1.20(EH) USB1.A12B1(GND) USB1.B12A1(GND) ; also on sheet 4 5
VBAT: C6.1 C9.2 C26.1 C27.1 CN3.1 U1.3(VOC_SAMP) U1.18(VBAT) U1.19(VSTOR) U2.13(BAT) U2.14(BAT) U3.2(CELL) U3.3(VDD)
VBUS: R31.1 U2.1(VBUS) USB1.A9B4(VBUS) USB1.B9A4(VBUS)
VDD3V3: C12.2 C20.1 C28.1 C29.1 C31.1 C34.1 FPC1.1 L1.1 R6.2 R7.1 R11.2 R12.1 R15.2 R16.2 R17.1 R18.1 R26.1 U10.2(3V3) U12.24(VDD) U13.6(VDD/NC) U13.10(VDD) U14.8(VDD) ; also on sheet 4 5
BAT_ALRT: R26.2 U3.5(ALRT#) U10.4(IO4)
GPIO35: SCLT.1 U10.28(IO35)
GPIO36: U10.29(IO36) UP.1
GPIO37: DOWN.1 U10.30(IO37)
GPS_EN: U8.3(EN) U12.4(IO0_0)
GPS_PPS: U10.32(IO39) ; also on sheet 4
GPS_RX: U10.35(IO42) ; also on sheet 4
GPS_TX: U10.34(IO41) ; also on sheet 4
GPS_VDD: C14.1 U8.5(VOUT) ; also on sheet 4
I2C_SCL: FPC1.4 R15.1 U2.5(SCL) U3.7(SCL) U10.17(IO9) U12.22(SCL) U13.2(SCL) U14.6(SCL) ; also on sheet 5
I2C_SDA: FPC1.3 R16.1 U2.6(SDA) U3.8(SDA) U10.12(IO8) U12.23(SDA) U13.3(SDA) U14.5(SDA) ; also on sheet 5
I2S_BCLK: U10.8(IO15) ; also on sheet 5
I2S_DIN: U10.10(IO17) ; also on sheet 5
I2S_DOUT: U10.11(IO18) ; also on sheet 5
I2S_LRCLK: U10.9(IO16) ; also on sheet 5
IO_EXP_INT: R17.2 U10.7(IO7) U12.1(INT#)
KB_BL: FPC1.6 U12.10(IO0_6)
KEY_INT: FPC1.5 U12.8(IO0_4)
LCD_RST: U12.7(IO0_3) ; also on sheet 5
LORA_BUSY: U10.23(IO21) ; also on sheet 4
LORA_CS: U10.18(IO10) ; also on sheet 4
LORA_EN: U7.3(EN) U12.5(IO0_1)
LORA_IRQ: U10.24(IO47) ; also on sheet 4
LORA_RST: U10.22(IO14) ; also on sheet 4
LORA_RXEN: U10.38(IO2) ; also on sheet 4
LORA_TXEN: U10.39(IO1) ; also on sheet 4
LORA_VDD: C16.1 U7.5(VOUT) ; also on sheet 4
MOTOR_EN: U12.9(IO0_5) U13.5(EN)
NFC_CS: U10.31(IO38) ; also on sheet 4
NFC_IRQ: U10.5(IO5) ; also on sheet 4
OUT+: M1.1(+) U13.7(OUT+)
OUT-: M1.2(-) U13.9(OUT-)
RTC_INT: R18.2 U10.6(IO6) U14.3(INT#)
SD_CS: U10.16(IO46) ; also on sheet 5
SD_EN: U6.3(EN) U12.6(IO0_2)
SD_VDD: C18.1 U6.5(VOUT) ; also on sheet 5
SPI_MISO: U10.20(IO12) ; also on sheet 4 5
SPI_MOSI: U10.19(IO11) ; also on sheet 4 5
SPI_SCK: U10.21(IO13) ; also on sheet 4 5
USB_DN: R13.2 U10.13(IO19)
USB_DP: R14.2 U10.14(IO20)
VSYS: C7.2 C8.1 C10.2 C11.2 C15.1 C17.1 C19.1 L2.2 U2.15(SYS) U2.16(SYS) U5.1(EN) U5.4(IN) U6.1(VIN) U7.1(VIN) U8.1(VIN)
$1N2347: R13.1 USB1.A7(D-) USB1.B7(D-)
$1N2386: R14.1 USB1.A6(D+) USB1.B6(D+)
$1N2532: R4.1 USB1.A5(CC1)
$1N2542: R3.1 USB1.B5(CC2)
$1N3408: R5.2 U2.9(CE)
$1N3887: L1.2 U5.3(LX)
$1N4158: C20.2 R6.1 U5.5(FB)
$1N4990: C21.1 L2.1 U2.19(SW) U2.20(SW)
$1N5023: R2.1 U2.11(TS)
$1N5118: C5.1 U2.23(PMID)
$1N5123: C21.2 U2.21(BTST)
$1N5181: C22.1 U2.22(REGN)
$1N5325: R8.1 U2.10(LIIM)
$1N5688: C24.2 U1.4(VREF_SAMP)
$1N5708: U1.20(LBOOST) U9.2
$1N6039: R9.1 R10.2 U1.7(VBAT_OV)
$1N6199: R9.2 U1.8(VRDIV)
$1N11385: LED1.1(C) U2.4(STAT)
$1N11463: LED1.2(A) R31.2
$2N1117: C30.2 R11.1 RESET.2 U10.3(EN)
$2N1346: BOOT.1 R12.2 U10.27(IO0)
$3N1457: C33.2 U14.1(OSCI) X1.2(OSC2)
$3N1692: C32.2 U14.2(OSCO) X1.1(OSC1)
$3N2493: C35.2 U13.1(REG)
Net-(C23-2): C23.2 CN1.1 U1.2(VIN_DC) U9.1

Not connected (* = marked no-connect by the designer): CN1 3* 4*; CN3 3* 4*; FPC1 7* 8*; U1 13(VBAT_OK)* 14(VOUT)* 16(LBUCK)*; U2 3(PG)* 7(INT)* 8(OTG)* 12(QON)* 24(NC)*; U3 1(CTG)*; U6 4(NC)*; U7 4(NC)*; U8 4(NC)*; U10 15(IO3)* 25(IO48)* 26(IO45)* 33(IO40)* 36(RXD0)* 37(TXD0)*; U12 11(IO0_7)* 13(IO1_0)* 14(IO1_1)* 15(IO1_2)* 16(IO1_3)* 17(IO1_4)* 18(IO1_5)* 19(IO1_6)* 20(IO1_7)*; U14 7(CLKOUT)*; USB1 A8(SBU1)* B8(SBU2)*

## Notes on the sheets
sheet 1
- Battery Charger
- Connection for the output of the boost charger.
  Connect at least a 4.7 µF capacitor in parallel
  with a 0.1 µF capacitor as close as possible to
  between this pin and pin 1 (VSS).
- These sense traces must be routed as a differential pair
  and kept as short as physically possible.
  Any noise here will ruin the capacity calculations.
- Solar Header
- I2C Address
  0x6B
- Fixed hardware address.
- Battery Fuel Gauge
- This creates a voltage divider
  that sets the hardware over-charge
  protection to exactly 4.2V for
  lithium polymer battery.
- I2C Address
  0x36
- note
  ----------
  *Fixed hardware address.
- typically :-
  100kΩ top resistor and 22.1kΩ bottom resistor to set a 3.3V output
- LDO 2: GPS Subsystem
- LDO 1: LoRa Subsystem
- These isolate the noisy RF components
  and allow the MCU to completely shut
  them down to save power.
- LDO 3: SD Card Interface
sheet 2
- When using a single power supply,
  the recommended power supply voltage is 3.3 V
  and the output current is
  no less than 500 mA
  in this design output current going to be more then 800mA
- ESP32-S3-
  WROOM-1U-N16R8
- To avoid any bootloader conflicts on the primary hardware
  UART (TXD0/RXD0), i am using the open GPIOs on the
  right side of the module for the GPS.
- LoRa SPI Bus
- SPI Chip Selects (CS):
- - LoRa CS (LORA_CS): IO10
- - NFC CS (NFC_CS): IO38
- - SD Card CS (SD_CS): IO46
sheet 3
- Note for me
- PCF85063AT/A	Real-Time Clock
- * don't change its, Fixed hardware address.
- I2C  blackberry-style keyboard module
- I2C Address - 0x51
- Note for me
- XL9555  I/O Expander
- * Set
- DRV2605LDGSR
- Note for me
- * Set by tying A0, A1, A2 to GND.
- I2C Address 0x20
- Turns the GPS LDO on/off
- Turns the LoRa LDO on/off
- Turns the SD Card LDO on/off
- Resets the OLED screen
- Interrupt from the keyboard
- Turns the vibration motor on/off
